# Altium schematic sheet Main.SchDoc
size A4
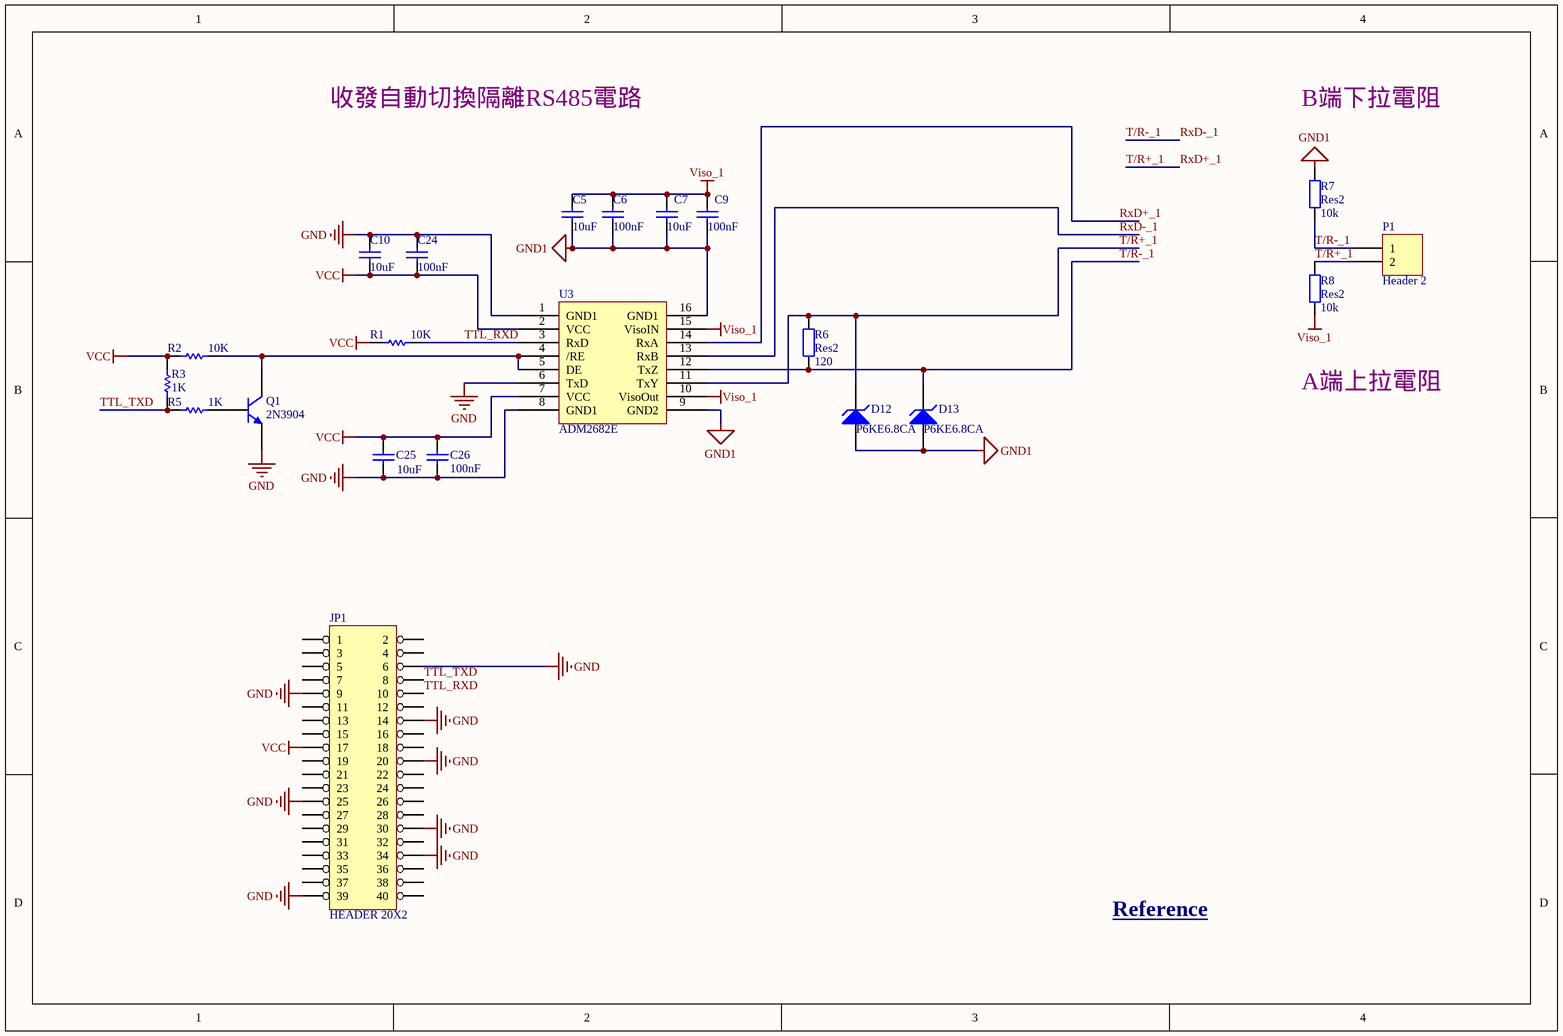
[diagram p0: Main.SchDoc]

## Parts
C5  value 10uF  [0805_C]  (hidden comment: Cap Semi)
C6  value 100nF  [SMD-0402C]  (hidden comment: Cap Semi)
C7  value 10uF  [0805_C]  (hidden comment: Cap Semi)
C9  value 100nF  [SMD-0402C]  (hidden comment: Cap Semi)
C10  value 10uF  [0805_C]  (hidden comment: Cap Semi)
C24  value 100nF  [SMD-0402C]  (hidden comment: Cap Semi)
C25  value 10uF  [0805_C]  (hidden comment: Cap Semi)
C26  value 100nF  [SMD-0402C]  (hidden comment: Cap Semi)
D12  P6KE6.8CA  [DIODE-0.4]
D13  P6KE6.8CA  [DIODE-0.4]
JP1  HEADER 20X2  [HDR2X20]
P1  Header 2  [歐式端子*2p]
Q1  2N3904  [SOT23_N]
R1  value 10K  [SMD-0402-RES]  (hidden comment: Res Semi)
R2  value 10K  [SMD-0402-RES]  (hidden comment: Res Semi)
R3  value 1K  [SMD-0402-RES]  (hidden comment: Res Semi)
R5  value 1K  [SMD-0402-RES]  (hidden comment: Res Semi)
R6  Res2  value 120  [SMD-0402-RES]
R7  Res2  value 10k  [SMD-0402-RES]
R8  Res2  value 10k  [SMD-0402-RES]
U3  ADM2682E  [SOIC127P1030-16N]

## Nets
GND: C10.2 C24.2 C25.1 C26.2 JP1.6 JP1.9 JP1.14 JP1.20 JP1.25 JP1.30 JP1.34 JP1.39 Q1.2(E) U3.1(GND1) U3.6(TxD) U3.8(GND1)
GND1: C5.1 C6.1 C7.1 C9.1 D12.1(A) D13.1(A) R7.2 U3.9(GND2) U3.16(GND1)
VCC: C10.1 C24.1 C25.2 C26.1 JP1.17 R1.2 R2.2 R3.1 U3.2(VCC) U3.7(VCC)
Viso_1: C5.2 C6.2 C7.2 C9.2 R8.1 U3.10(VisoOut) U3.15(VisoIN)
RxD+_1: D12.2(K) P1.2 R6.2 R8.2 U3.11(TxY) U3.14(RxA)  [also labelled T/R+_1]
RxD-_1: D13.2(K) P1.1 R6.1 R7.1 U3.12(TxZ) U3.13(RxB)  [also labelled T/R-_1]
TTL_RXD: JP1.10 R1.1 U3.3(RxD)
TTL_TXD: JP1.8 R3.2 R5.2
NetQ1_1: Q1.1(C) R2.1 U3.4(/RE) U3.5(DE)
NetQ1_3: Q1.3(B) R5.1

Not connected (* = marked no-connect by the designer): JP1 1 2 3 4 5 7 11 12 13 15 16 18 19 21 22 23 24 26 27 28 29 31 32 33 35 36 37 38 40

## Notes on the sheet
- 收發自動切換隔離RS485電路
- B端下拉電阻
- A端上拉電阻
- Reference <https://blog.csdn.net/electrocrazy/article/details/72356631?utm_source=copy>

## Library data of the parts
C5 C7 C10 C25 = Cap Semi: Cap-10uF; Published: 8-Jun-2000; LatestRevisionDate: 29-May-2009; LatestRevisionNote: IPC-7351 Footprint Added.; PackageReference: C1206; Publisher: Altium Limited; PackageDescription: Chip Capacitor
C6 C9 C24 C26 = Cap Semi: Cap-0.1uF; Published: 8-Jun-2000; LatestRevisionDate: 29-May-2009; LatestRevisionNote: IPC-7351 Footprint Added.; PackageReference: C1206; Publisher: Altium Limited; PackageDescription: Chip Capacitor
D12 D13 = D Zener: Zener Diode; Published: 8-Jun-2000; LatestRevisionDate: 17-Jul-2002; LatestRevisionNote: Re-released for DXP Platform.; PackageReference: DIODE-0.7; Publisher: Altium Limited
P1 = Header 2: Header, 2-Pin; LatestRevisionDate: 17-Jul-2002; LatestRevisionNote: Re-released for DXP Platform.; Publisher: Altium Limited
Q1 = 2N3904: NPN General Purpose Amplifier; Published: 8-Jun-2000; LatestRevisionDate: 15-Jan-2003; LatestRevisionNote: PCB Footprint 'BCY-W3/D4.7' replaced; DatasheetVersion: 1997; PackageVersion: Sep-1998; PackageReference: TO-92A; Publisher: Altium Limited; Code_JEDEC: TO-92A; ComponentLink1Description: Manufacturer Link; ComponentLink1URL: http://www.fairchildsemi.com/; ComponentLink2Description: Datasheet; ComponentLink2URL: http://www.fairchildsemi.com/ds/2N%2F2N3904.pdf
R1 R2 = Res Semi: Res-10k; Published: 8-Jun-2000; LatestRevisionDate: 17-Jul-2002; LatestRevisionNote: Re-released for DXP Platform.; PackageReference: AXIAL-0.5; Publisher: Altium Limited
R3 R5 = Res Semi: Res-1k; Published: 8-Jun-2000; LatestRevisionDate: 17-Jul-2002; LatestRevisionNote: Re-released for DXP Platform.; PackageReference: AXIAL-0.5; Publisher: Altium Limited
R6 = Res2: Res-120; Published: 8-Jun-2000; LatestRevisionDate: 17-Jul-2002; LatestRevisionNote: Re-released for DXP Platform.; PackageReference: AXIAL-0.4; Publisher: Altium Limited
R7 R8 = Res2: Res-10k; Published: 8-Jun-2000; LatestRevisionDate: 17-Jul-2002; LatestRevisionNote: Re-released for DXP Platform.; PackageReference: AXIAL-0.4; Publisher: Altium Limited
U3 = ADM2682E: isolation RS422 with isolated power